# Altium project POV_Player.PrjPCB
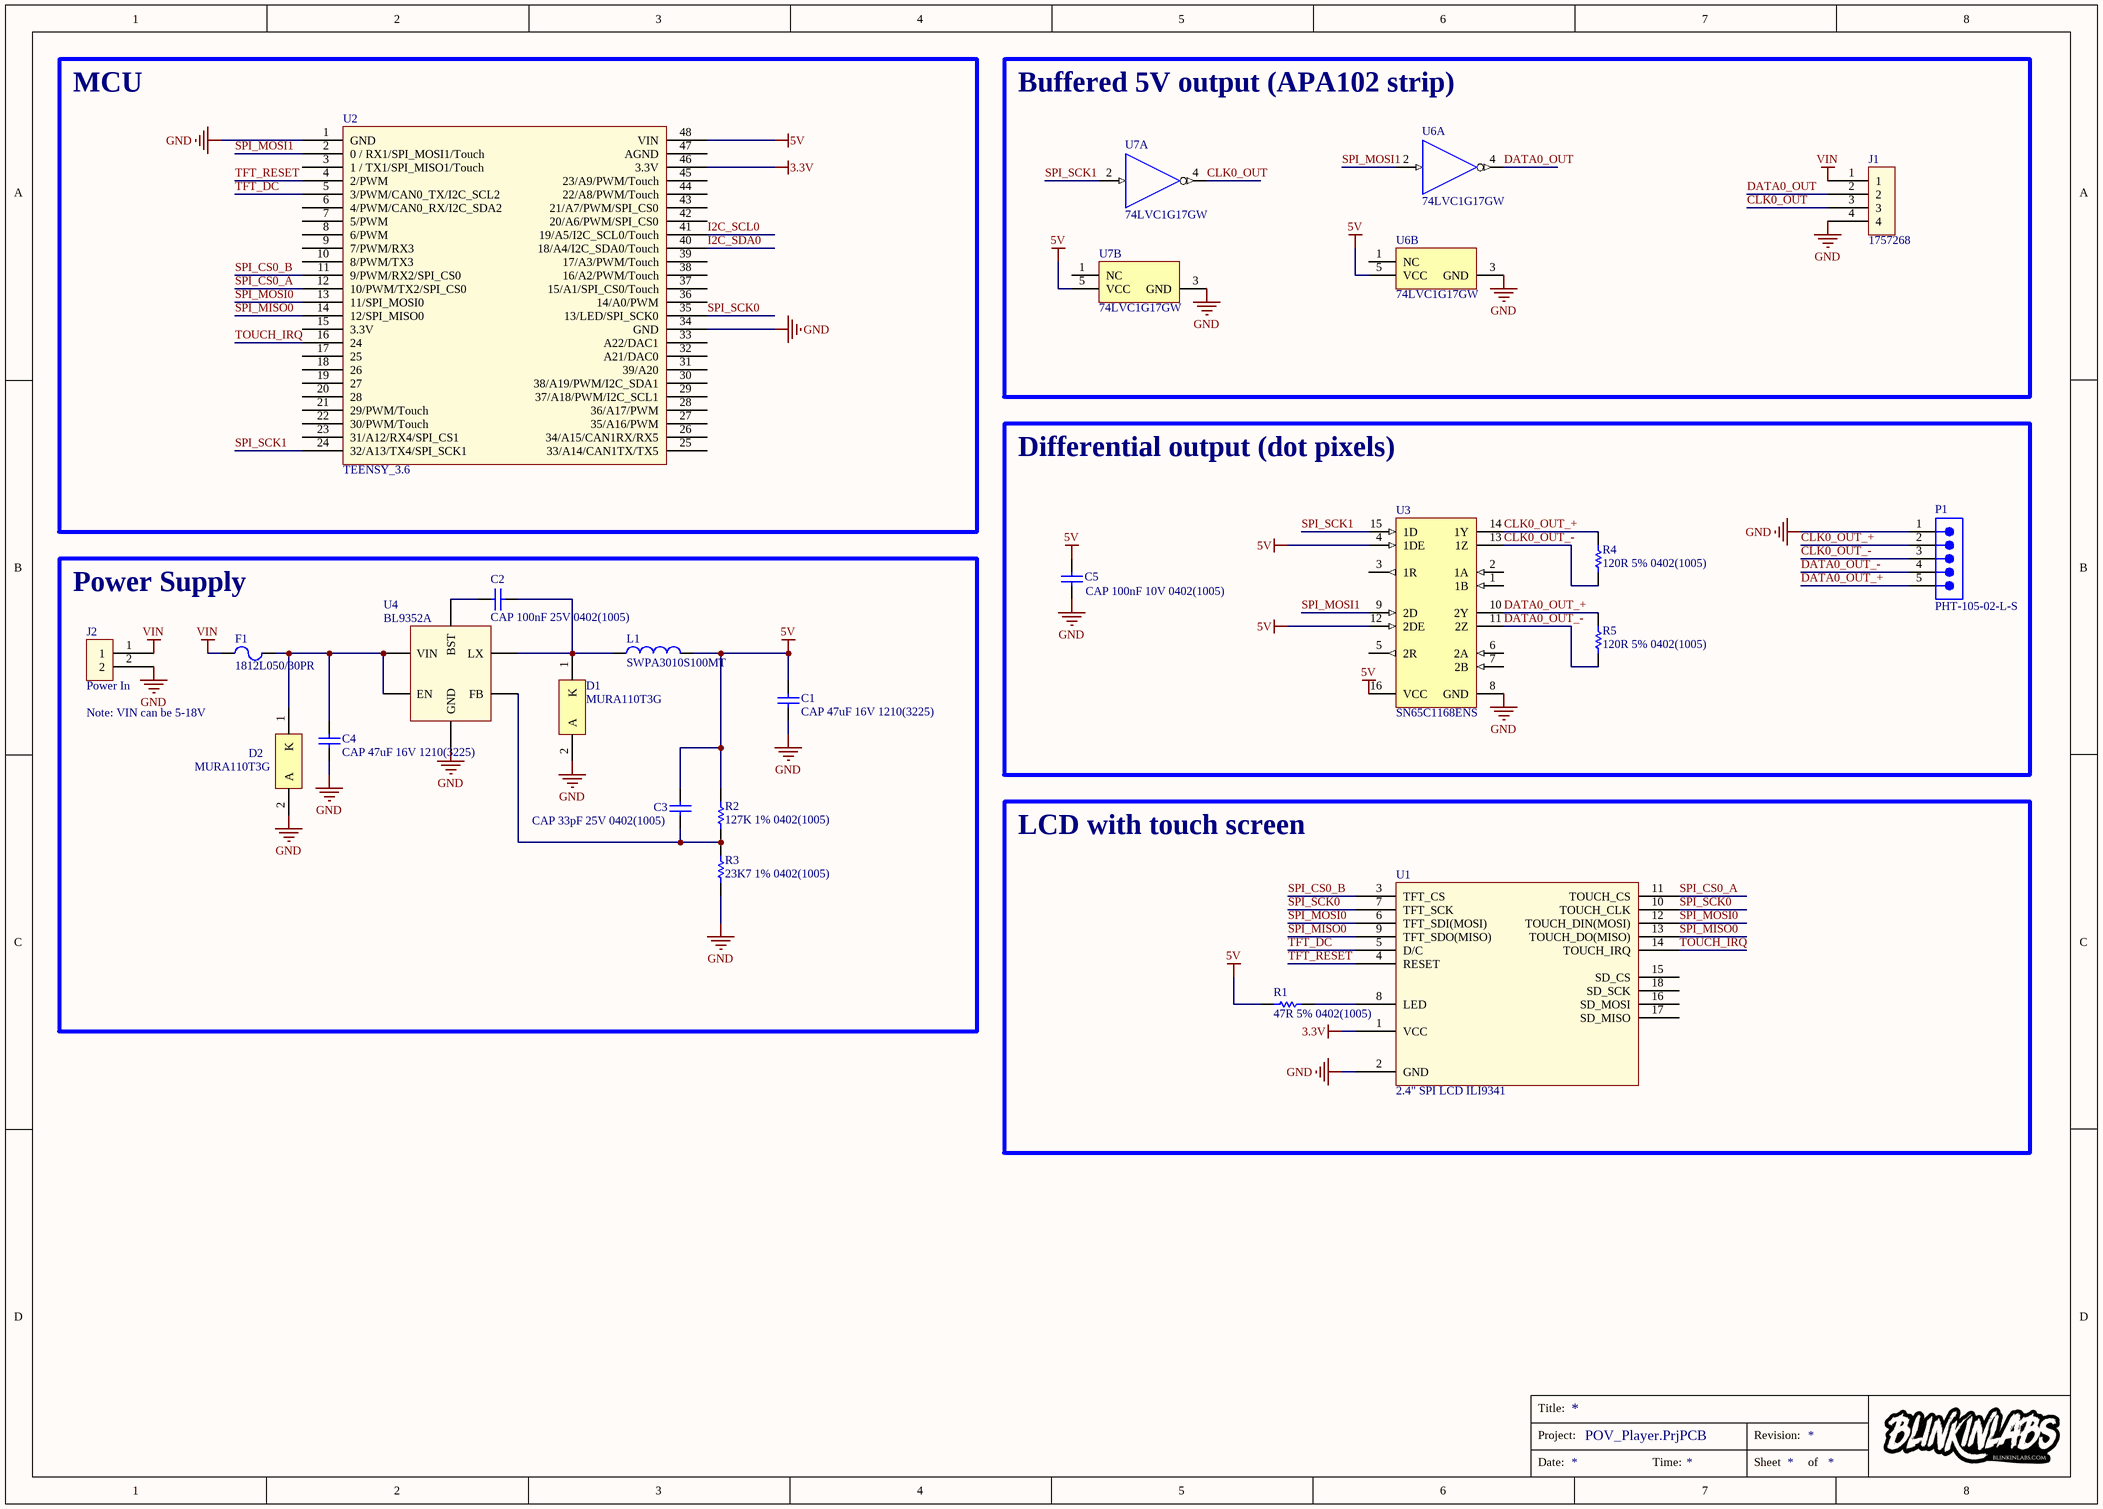
[diagram p0: board.SchDoc]
1 sheet, 23 parts. Net scope: global (net labels, ports and power ports of the same name join across sheets).
Board file: board.PcbDoc

## Sheet board.SchDoc
size A3; Organization: Blinkinlabs, LLC

### Parts
C1  CAP 47uF 16V 1210(3225)  [CAPC1210(3225)280_L]
C2  CAP 100nF 25V 0402(1005)  [CAPC0402(1005)60_L]
C3  CAP 33pF 25V 0402(1005)  [CAPC0402(1005)60_L]
C4  CAP 47uF 16V 1210(3225)  [CAPC1210(3225)280_L]
C5  CAP 100nF 10V 0402(1005)  [CAPC0402(1005)60_L]
D1  MURA110T3G  [ONSC-SMA-2-403D-02_V]
D2  MURA110T3G  [ONSC-SMA-2-403D-02_V]
F1  1812L050/30PR  [LFUS-1812L05030PR_V]
J1  1757268  [1757268]
J2  Power In  [1757242]
L1  SWPA3010S100MT  [SWPA3010S]
P1  PHT-105-02-L-S  [SMTC-PHT-105-02-X-S]
R1  47R 5% 0402(1005)  [RESC0402(1005)_N]
R2  127K 1% 0402(1005)  [RESC0402(1005)_L]
R3  23K7 1% 0402(1005)  [RESC0402(1005)_L]
R4  120R 5% 0402(1005)  [RESC0402(1005)_N]
R5  120R 5% 0402(1005)  [RESC0402(1005)_N]
U1  2.4" SPI LCD ILI9341  [2.4" SPI LCD ILI9341]
U2  TEENSY_3.6  [TEENSY3.6-THRU_HOLE]
U3  SN65C1168ENS  [NS0016A_N]
U4  BL9352A  [SOT95P280X125-6N]
U6  74LVC1G17GW  [NXP-SOT353-1_L]  (parts A,B of 2)
U7  74LVC1G17GW  [NXP-SOT353-1_L]  (parts A,B of 2)

### Blocks framed on the sheet
MCU: U2
Buffered 5V output (APA102 strip): J1 U6 U7
Differential output (dot pixels): C5 P1 R4 R5 U3
Power Supply: C1-C4 D1 D2 F1 J2 L1 R2 R3 U4
LCD with touch screen: R1 U1

### Nets
3.3V: U1.1(VCC) U2.46(3.3V)
5V: C1.2 C3.2 C5.2 L1.2 R1.1 R2.2 U2.48(VIN) U3.4(1DE) U3.12(2DE) U3.16(VCC) U6.5(VCC) U7.5(VCC)
GND: C1.1 C4.1 C5.1 D1.2(A) D2.2(A) J1.4 J2.2 P1.1 R3.1 U1.2(GND) U2.1(GND) U2.34(GND) U3.8(GND) U4.2(GND) U6.3(GND) U7.3(GND)
VIN: F1.1 J1.1 J2.1
CLK0_OUT: J1.3 U7.4(~{Y})
CLK0_OUT_+: P1.2 R4.2 U3.14(1Y)
CLK0_OUT_-: P1.3 R4.1 U3.13(1Z)
DATA0_OUT: J1.2 U6.4(~{Y})
DATA0_OUT_+: P1.5 R5.2 U3.10(2Y)
DATA0_OUT_-: P1.4 R5.1 U3.11(2Z)
I2C_SCL0: U2.41(19/A5/I2C_SCL0/Touch)
I2C_SDA0: U2.40(18/A4/I2C_SDA0/Touch)
SPI_CS0_A: U1.11(TOUCH_CS) U2.12(10/PWM/TX2/SPI_CS0)
SPI_CS0_B: U1.3(TFT_CS) U2.11(9/PWM/RX2/SPI_CS0)
SPI_MISO0: U1.9(TFT_SDO(MISO)) U1.13(TOUCH_DO(MISO)) U2.14(12/SPI_MISO0)
SPI_MOSI0: U1.6(TFT_SDI(MOSI)) U1.12(TOUCH_DIN(MOSI)) U2.13(11/SPI_MOSI0)
SPI_MOSI1: U2.2(0_/_RX1/SPI_MOSI1/Touch) U3.9(2D) U6.2(A)
SPI_SCK0: U1.7(TFT_SCK) U1.10(TOUCH_CLK) U2.35(13/LED/SPI_SCK0)
SPI_SCK1: U2.24(32/A13/TX4/SPI_SCK1) U3.15(1D) U7.2(A)
TFT_DC: U1.5(D/C) U2.5(3/PWM/CAN0_TX/I2C_SCL2)
TFT_RESET: U1.4(RESET) U2.4(2/PWM)
TOUCH_IRQ: U1.14(TOUCH_IRQ) U2.16(24)
NetC2_1: C2.1 U4.1(BST)
NetC2_2: C2.2 D1.1(K) L1.1 U4.6(LX)
NetC3_1: C3.1 R2.1 R3.2 U4.3(FB)
NetC4_2: C4.2 D2.1(K) F1.2 U4.4(EN) U4.5(VIN)
NetR1_2: R1.2 U1.8(LED)

Not connected (* = marked no-connect by the designer): U1 15(SD_CS) 16(SD_MOSI) 17(SD_MISO) 18(SD_SCK); U2 3(1_/_TX1/SPI_MISO1/Touch) 6(4/PWM/CAN0_RX/I2C_SDA2) 7(5/PWM) 8(6/PWM) 9(7/PWM/RX3) 10(8/PWM/TX3) 15(3.3V) 17(25) 18(26) 19(27) 20(28) 21(29/PWM/Touch) 22(30/PWM/Touch) 23(31/A12/RX4/SPI_CS1) 25(33/A14/CAN1TX/TX5) 26(34/A15/CAN1RX/RX5) 27(35/A16/PWM) 28(36/A17/PWM) 29(37/A18/PWM/I2C_SCL1) 30(38/A19/PWM/I2C_SDA1) 31(39/A20) 32(A21/DAC0) 33(A22/DAC1) 36(14/A0/PWM) 37(15/A1/SPI_CS0/Touch) 38(16/A2/PWM/Touch) 39(17/A3/PWM/Touch) 42(20/A6/PWM/SPI_CS0) 43(21/A7/PWM/SPI_CS0) 44(22/A8/PWM/Touch) 45(23/A9/PWM/Touch) 47(AGND); U3 1(1B) 2(1A) 3(1R) 5(2R) 6(2A) 7(2B); U6 1(NC); U7 1(NC)

### Notes on the sheet
- Note: VIN can be 5-18V
- Title:
- Project:
- Revision:
- Date:
- Time:
- Sheet
- of

### Library data of the parts
C1 C4 = CMP-1038-02296-1: CAP 47uF 16V ±20% 1210 (3225 Metric) Thickness 2.8mm SMD; Case-EIA: 1210; Case-Metric: 3225; Tolerance: Â±20%; Value: 47uF; Technology: SMT; Max Thickness: 2.8 mm; Rated Voltage: 16 V
C2 = CMP-1034-02073-1: CAP 100nF 25V ±20% 0402 (1005 Metric) Thickness 0.6mm SMD; Tolerance: Â±20%; Case-EIA: 0402; Case-Metric: 1005; Rated Voltage: 25 V; Value: 100nF; Max Thickness: 0.6 mm; Technology: SMT
C3 = CMP-1034-00998-1: CAP 33pF 25V ±5% 0402 (1005 Metric) Thickness 0.6mm SMD; Case-EIA: 0402; Tolerance: Â±5%; Case-Metric: 1005; Value: 33pF; Max Thickness: 0.6 mm; Technology: SMT; Rated Voltage: 25 V
C5 = CMP-1034-02065-1: CAP 100nF 10V ±10% 0402 (1005 Metric) Thickness 0.6mm SMD; Case-EIA: 0402; Case-Metric: 1005; Tolerance: Â±10%; Max Thickness: 0.6 mm; Value: 100nF; Rated Voltage: 10 V; Technology: SMT
D1 D2 = CMP-0902-00293-1: Surface Mount Ultrafast Power Rectifier, 2-Pin SMA, Pb-Free, Tape and Reel; Manufacturer: On Semiconductor; IFSM Max (A): 50; Type: Ultrafast; PackageReference: SMA-2-403D-02; ComponentLink3URL: http://www.onsemi.com/pub_link/Collateral/403D-02.PDF; PackageDescription: 2-Pin Small Molded Package, J-Bend Lead, Body 2.605 x 4.315 mm; ComponentLink3Description: Package Specification; PartNumber: MURA110T3G; Mounting Technology: Surface Mount; RoHS: TRUE; DatasheetVersion: Rev. 5; ComponentLink1URL: http://www.onsemi.com/; Packing: Tape and Reel; ComponentLink1Description: Manufacturer URL; ComponentLink2Description: Datasheet; PackageVersion: Rev. G, 07/2012; ComponentLink2URL: http://www.onsemi.cn/pub_link/Collateral/MURA105T3-D.PDF
F1 = CMP-2000-05508-1: PTC Resettable Fuse, 0.8 W, 30 V, -40 to 85 degC, 2-Pin SMD, RoHS, Tape and Reel; Manufacturer: Littelfuse-Inc.; Voltage - Max: 30V; Current - Hold (Ih) (Max): 500mA; Time to Trip: 0.15s; Current - Max: 100A; R Min/Max: 0.150~1.000Ohm; Current - Trip (It): 1A; Package Reference: 1812; Family: PTCResettableFuses; Packaging: Tape&Reel(TR); Package / Case: 1812(4532Metric),Concave; Series: POLY-FUSE®,1812L; Mounting Technology: SurfaceMount; Datasheet Version: 02/2016; Datasheet URL: http://www.littelfuse.com/~/media/electronics/datasheets/resettable_ptcs/littelfuse_ptc_1812l_datasheet.pdf.pdf; Manufacturer URL: http://www.littelfuse.com/; Category: CircuitProtection; Package Description: 2-Pin Surface Mount Device, Body 4.55 x 3.24 mm
J1 = 1757268: TERM BLOCK HDR 4POS 90DEG 5.08MM; Manufacturer: Phoenix Contact; ComponentLink2Description: Datasheet; ComponentLink2URL: 1757268_06_en_00.pdf; PartNumber: 1757268
J2 = 1757242: TERM BLOCK HDR 2POS 90DEG 5.08MM; Manufacturer: Phoenix Contact; PartNumber: 1757268; ComponentLink2Description: Datasheet; ComponentLink2URL: 1757268_06_en_00.pdf
L1 = SWPA3010S100MT: Wire Wound SMD Power Inductors 3010 3.0×3.0×1.0 10uH, .75A
P1 = CMP-1024-00186-1: Press Fit Header, Through-hole, Vertical, -55 to 125 degC, 2.54 mm Pitch, 5-Pin, Male, RoHS; Manufacturer: Samtec; Pitch: 2.54 mm; ComponentLink3URL: http://www.samtec.com/documents/webfiles/cpdf/PHT-1XX-XX-X-X-XXX-MKT.pdf; ComponentLink2Description: Datasheet; Temperature Range: -55 to 125 degC; RoHS: True; PackageVersion: J, 9/2009; PartNumber: PHT-105-02-L-S; ComponentLink2URL: http://www.samtec.com/documents/webfiles/pdf/pht.pdf; ComponentLink3Description: Package Specification; Mounting Technology: Through-hole; Orientation: Vertical; PackageReference: PHT-105-02-X-S; PackageDescription: .100 Press Fit Socket Assembly; ComponentLink1Description: Manufacturer URL; DatasheetVersion: F-214; ComponentLink1URL: http://www.samtec.com
R1 = CMP-1011-00042-1: 47R 0.063W 5% 0402 (1005 Metric)  SMD; Case-Metric: 1005; Case-EIA: 0402; Value: 47.00 Ohm; Tolerance: 5 %; Power: 0.063 W; Technology: SMT
R2 = CMP-1011-00747-1: 127K 0.063W 1% 0402 (1005 Metric)  SMD; Case-EIA: 0402; Value: 127000.00 Ohm; Case-Metric: 1005; Tolerance: 1 %; Technology: SMT; Power: 0.063 W
R3 = CMP-1011-00663-1: 23K7 0.063W 1% 0402 (1005 Metric)  SMD; Case-Metric: 1005; Case-EIA: 0402; Value: 23700.00 Ohm; Tolerance: 1 %; Technology: SMT; Power: 0.063 W
R4 R5 = CMP-1011-00052-1: 120R 0.063W 5% 0402 (1005 Metric)  SMD; Value: 120.00 Ohm; Case-EIA: 0402; Case-Metric: 1005; Technology: SMT; Tolerance: 5 %; Power: 0.063 W
U1 = 2.4" SPI LCD ILI9341: Generic 2.4 inch SPI LCD TFT serial module 240x320 with touch ILI9341
U2 = TEENSY_3.6: Teensy 3.6
U3 = CMP-0310-00409-2: Dual Differential Driver and Receiver with +/-15-kV IEC ESD Protection, 2 TX / 2 RX, 5V, -40 to 85 degC, 16-Pin SO (NS), Green (RoHS & no Sb/Br); Manufacturer: Texas Instruments; ICC(Max)(mA): 9; ESD(kV): 15; Supply Voltage(s)(V): 5; Drivers Per Package: 2; SubFamily: RS-422; Rating: Catalog; Mounting Technology: Surface Mount; ComponentLink2URL: http://www.ti.com/litv/pdf/msop002a; PartNumber: SN65C1168ENS; PackageReference: NS0016A; Receivers Per Package: 2; Eco-Plan: Green (RoHS & no Sb/Br); ComponentLink1URL: http://www.ti.com/general/docs/lit/getliterature.tsp?genericPartNumber=SN65C1168E&fileType=pdf; # of TX/RX: 2 TX / 2 RX; ComponentLink2Description: Package Specification; Footprint: MC34051; DatasheetVersion: SLLS740A; ComponentLink1Description: Datasheet; PackageVersion: revC, Mar-2003; PackageDescription: 16-Pin Plastic Small Outline Package, 10.2 x 5.3 mm, Pitch 1.27 mm Pitch
U4 = BL9352A: 45V, 1.6MHz, 600mA Step-Down Converter
U6 U7 = CMP-2000-05689-1: Single Schmitt Trigger Buffer, 1.65 to 5.5 V, -40 to 125 degC, 5-Pin TSSOP (SOT353-1), RoHS, Tape and Reel; Manufacturer: NXP Semiconductors; Output Type: SingleEnded; Maximum High Level Output Current: -32mA; Maximum Propagation Delay Time @ Maximum CL: 14ns; Maximum Operating Supply Voltage: 5.5V; Schmitt Trigger Input: Yes; Number of Channels: 1; Minimum Operating Supply Voltage: 1.65V; Polarity: Non-Inverting; Logic Family: LVC; Maximum Low Level Output Current: 32mA; Width: 1.35mm; Maximum Operating Temperature: +125°C; Package Description: 5-Pin Thin Shrink Small Outline Package, Body 2.05 x 1.25 mm, Pitch 0.65 mm; Length: 2.25mm; Package Type: TSSOP; Dimensions: 2.25x1.35x1mm; Datasheet URL: http://www.nxp.com/documents/data_sheet/74LVC1G17.pdf?fasp=1&WT_TYPE=Data%20Sheets&WT_VENDOR=FREESCALE&WT_FILE_FORMAT=pdf&WT_ASSET=Documentation&fileExt=.pdf; Package Reference: SOT353-1; Mounting Technology: SurfaceMount; Logic Function: Buffer; Package URL: http://www.nxp.com/documents/outline_drawing/SOT353-1.pdf; Input Type: SchmittTrigger; Mounting Type: SurfaceMount; Datasheet Version: Rev. 10, 06/2012; Manufacturer URL: http://www.nxp.com/; Pin Count: 5; Height: 1mm; Minimum Operating Temperature: -40°C; PartId: 1